# EAGLE design Tipper Remote Base Unit (EAGLE 9.6.2)
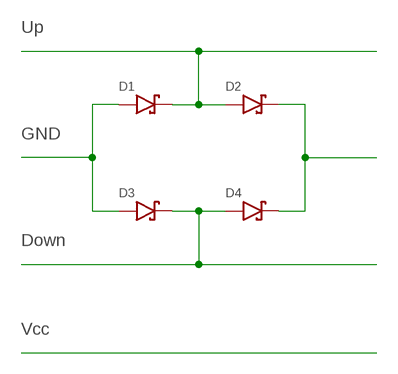
[diagram p0: schematic, sheet 1]

## Parts
D1  DIODE-SCHOTTKY-20SQ045  [DIODE_R-6]
D2  DIODE-SCHOTTKY-20SQ045  [DIODE_R-6]
D3  DIODE-SCHOTTKY-20SQ045  [DIODE_R-6]
D4  DIODE-SCHOTTKY-20SQ045  [DIODE_R-6]

## Nets
N$1: D1.C D2.A
N$2: D3.C D4.A
N$3: D1.A D3.A
N$4: D2.C D4.C

## Notes on the sheet
- Up
- GND
- Down
- Vcc

## Library data of the parts
D1-D4 = digitalconcepts:DIODE-SCHOTTKY-20SQ045: Schottky Diode

## Board
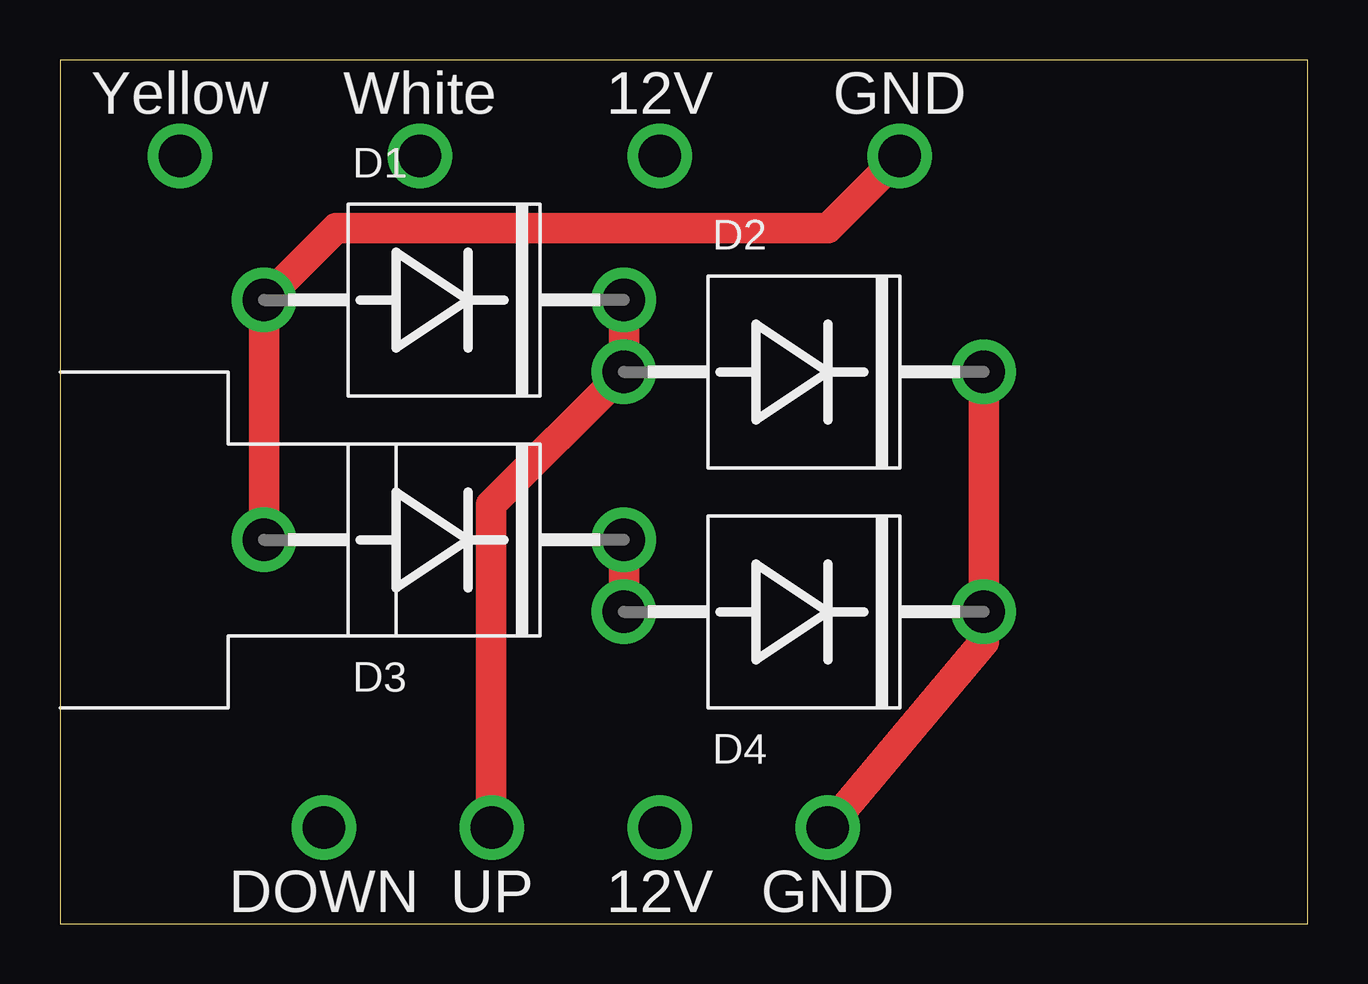
[diagram p1: board, top side]
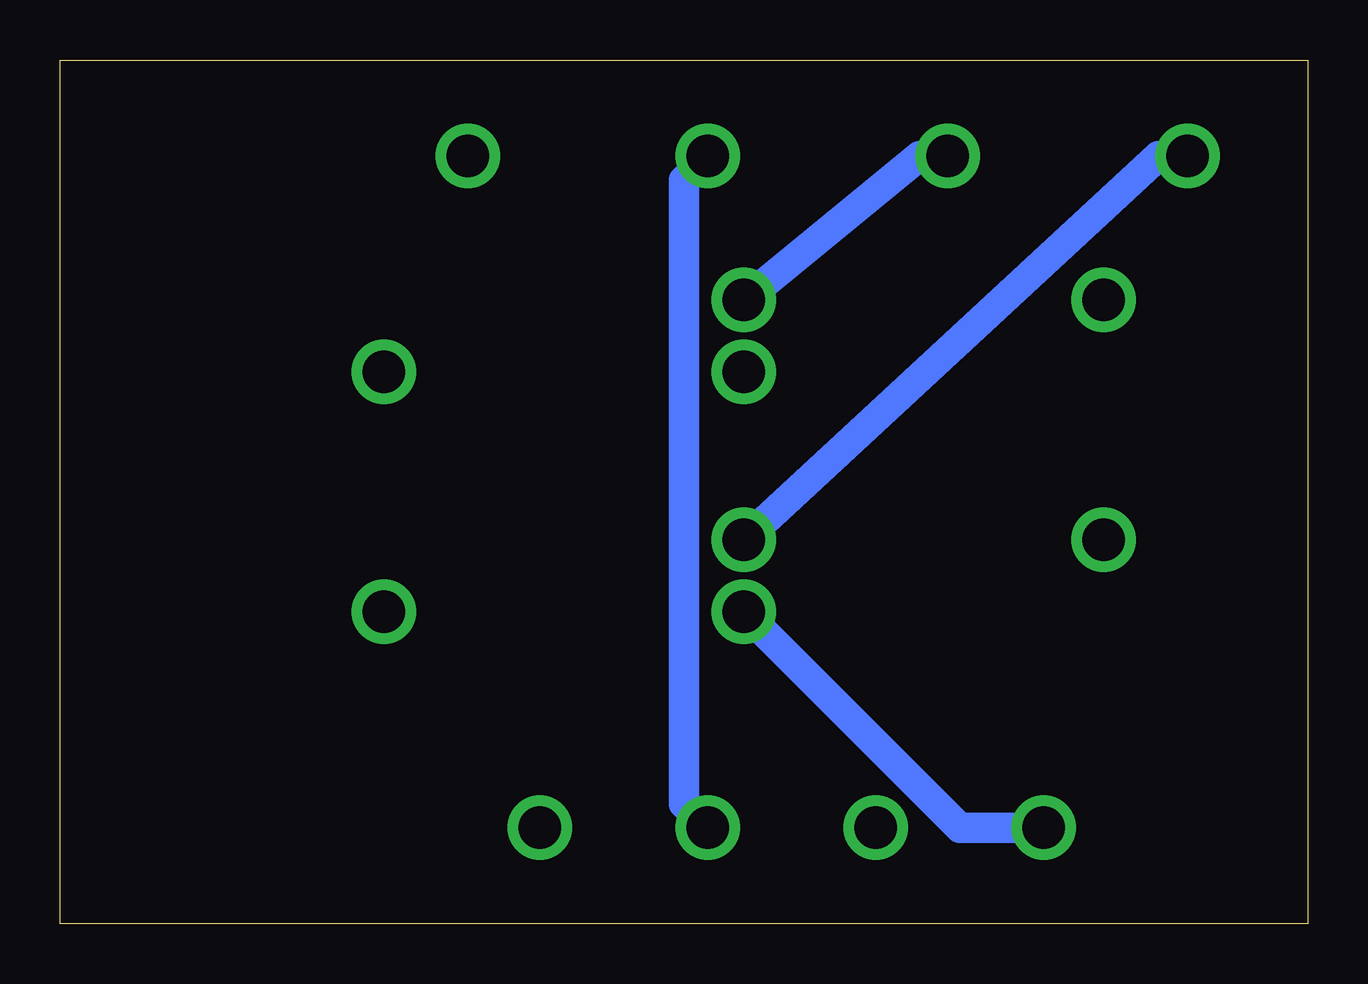
[diagram p2: board, bottom side, seen from below]

Size 52 x 36 mm. Coordinates in mm from the lower left corner, seen from the top.
Outline: 0,0 52,0 52,36 0,36 0,0
Copper layers (1*16): Top 0.035mm / dielectric 1.5mm / Bottom 0.035mm
Design rules "default": minimum track width 6mil, minimum drill 0.35mm, track to track 6mil, track to pad 6mil, pad to pad 6mil, via to via 6mil, smd to smd 6mil, copper to edge 40mil, drill to drill 6mil, minimum pad ring 10mil, minimum via ring 8mil, stop-mask expansion 4mil, vias tented up to drill 0mil, thermal gap 10mil

### Footprints (pad centres in the part's own frame; a part is rotated, then mirrored left to right if it is on the bottom)
DIODE_R-6 = drill 1.778: A -7.5,0; C 7.5,0

### Placement (x,y rotation side)
D1  16,26 0 top
D2  31,23 0 top
D3  16,16 0 top
D4  31,13 0 top

### Tracks (layer width: path | path; a pad name or v marks a point on that pad's centre or on a via)
N$1  (via drill 1.78)
  Top 1.27: D1.C D2.A 17.96,17.46 17.96,17 17.96,4.04 v18,4
  Bottom 1.27: v15,32 16.18,32 D1.C
N$2  (via drill 1.78)
  Top 1.27: D3.C D4.A
  Bottom 1.27: v5,32 6.22,32 D3.C | D4.A 14.5,4 v11,4
N$3  (via drill 1.78)
  Top 1.27: D3.A D1.A 11.5,29 32,29 v35,32
N$4  (via drill 1.78)
  Top 1.27: D2.C D4.C 38.5,11.74 v32,4
N$6  (via drill 1.78)
  Bottom 1.27: v25,4 26,5 26,31 v25,32

### Text on the board
tNames: Yellow | White | 12V | GND | DOWN | UP | 12V | GND